# EasyEDA Pro project C题视觉追踪v4.eprj

# Schematic Schematic1
Board Name: Board1; Create Date: 2025-04-20; Page Name: P1; Project Name: C题视觉追踪v4; Schematic Name: Schematic1; Update Date: 2025-05-27; Company: 嘉立创EDA; Page Size: A4; Version: V1.0
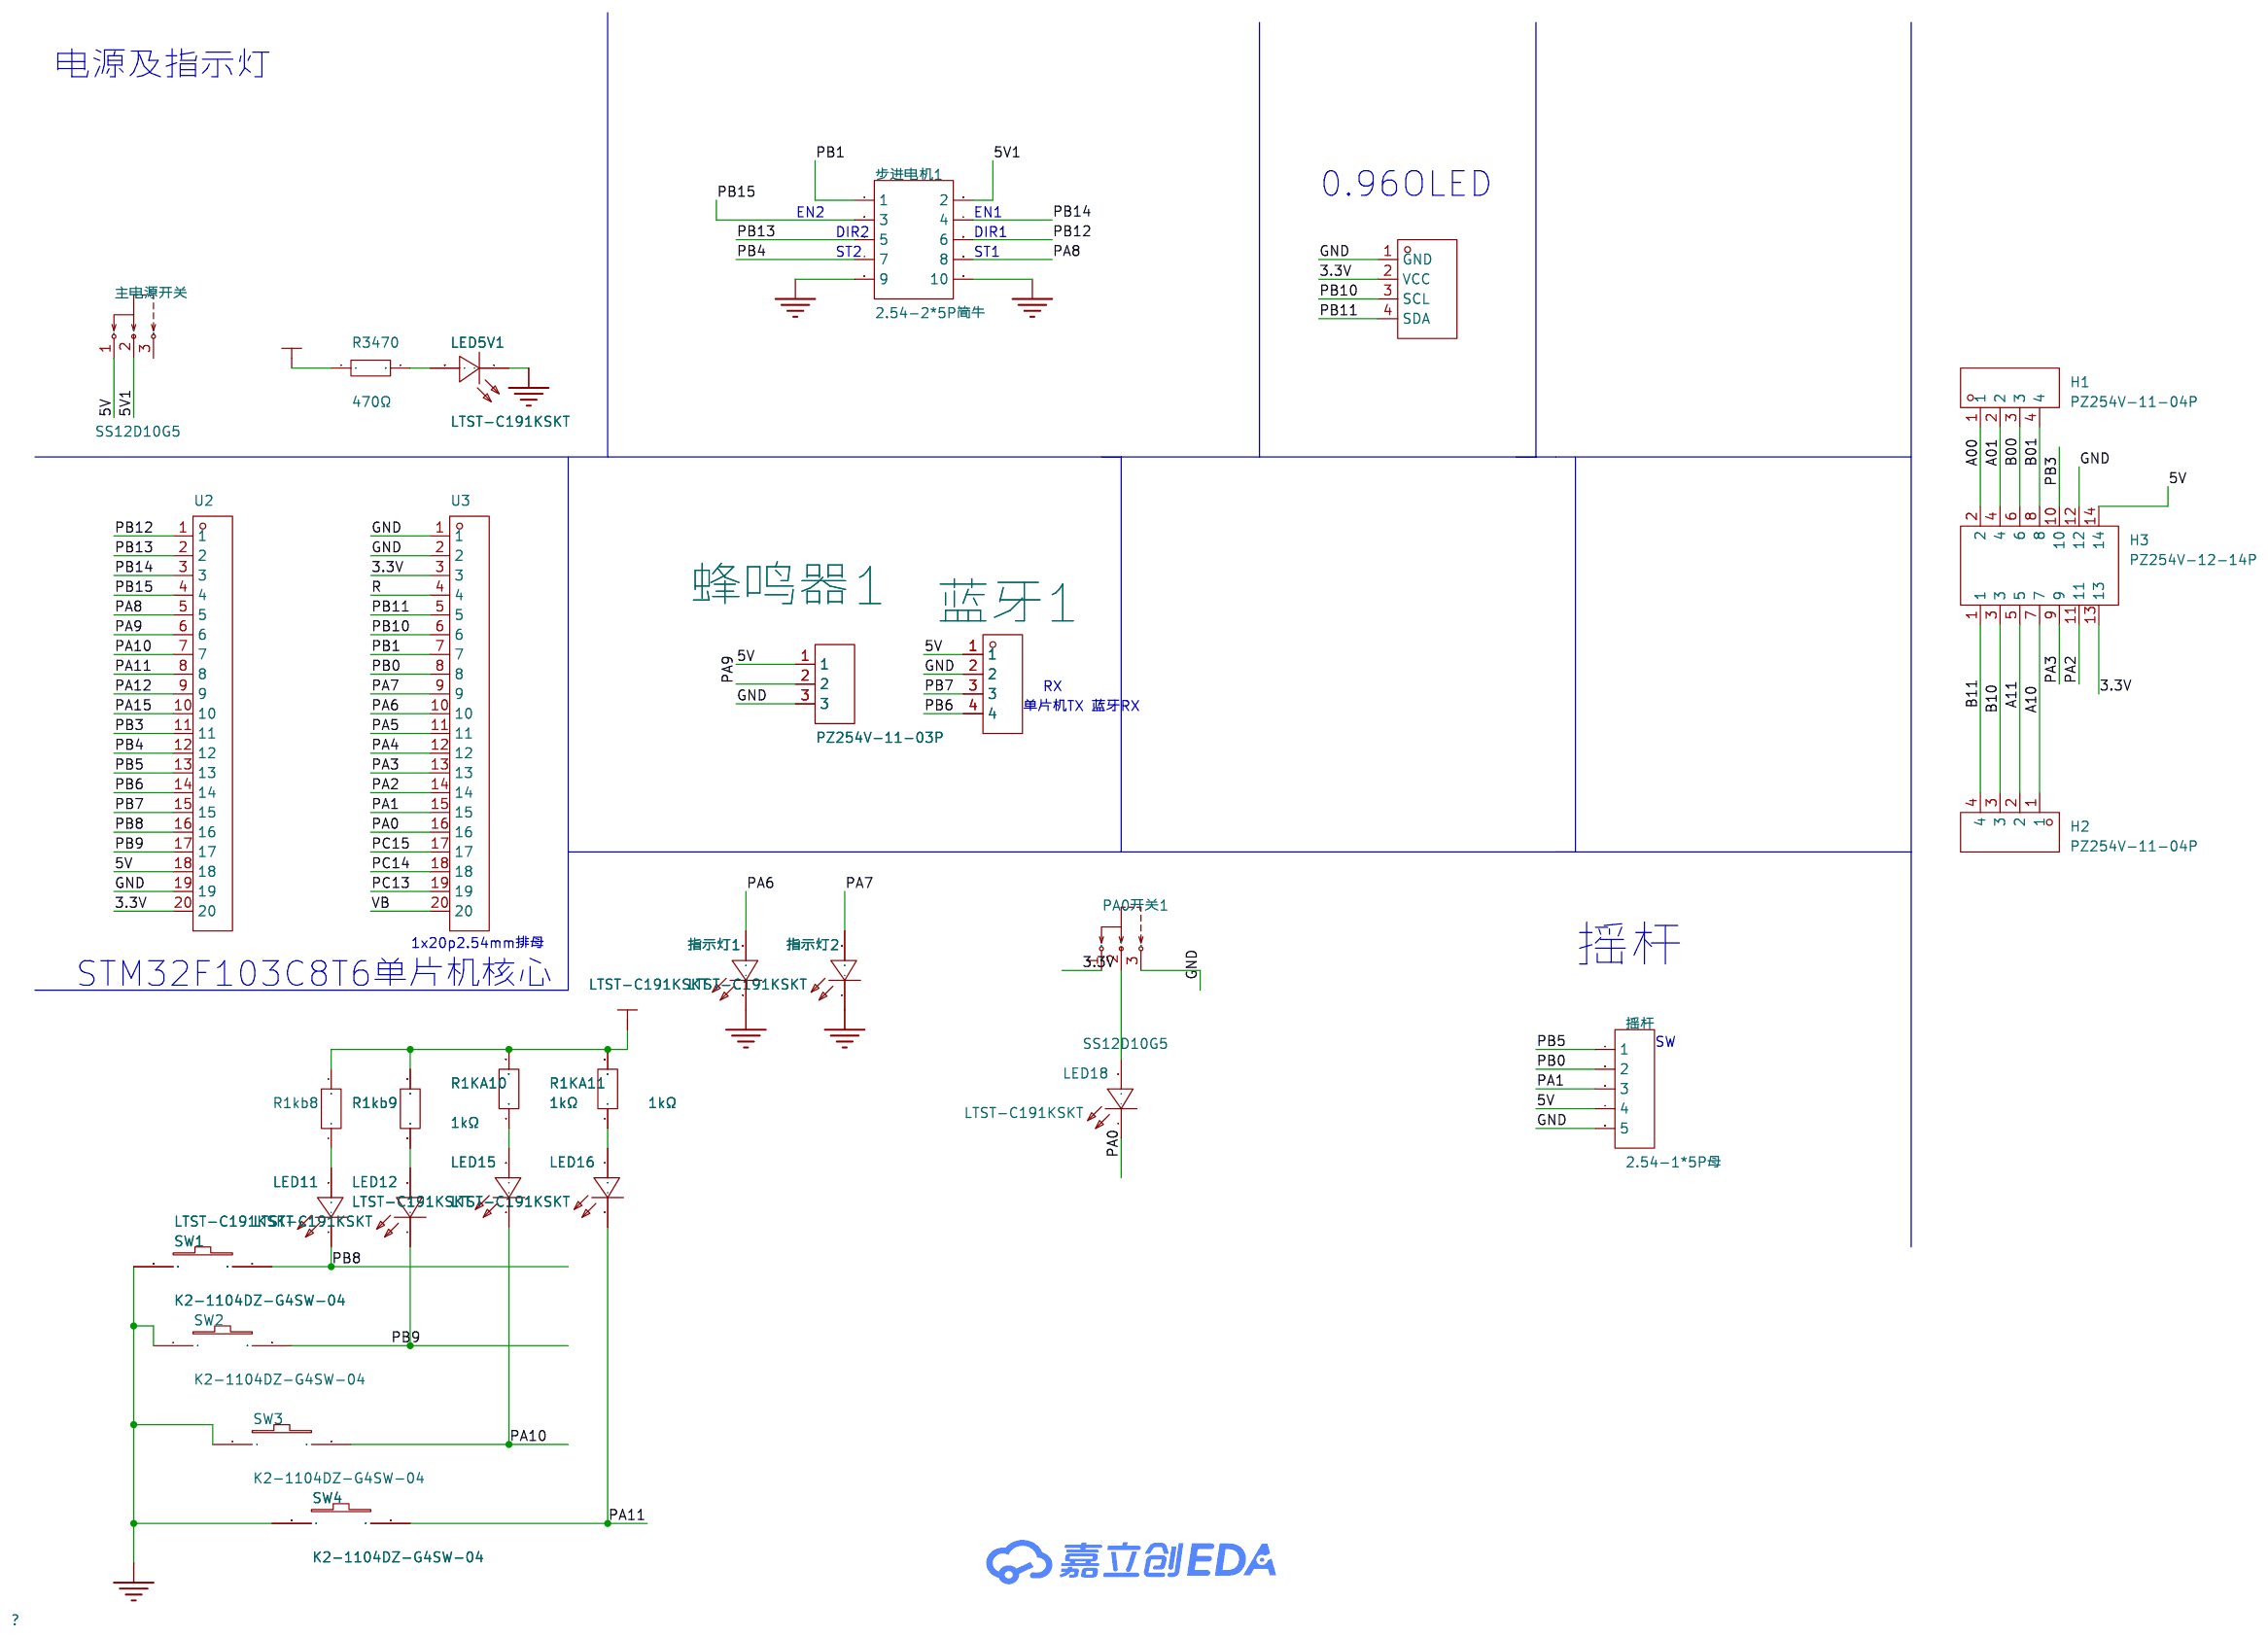
[diagram p0: schematic sheet]

## Parts
H1  PZ254V-11-04P  [HDR-TH_4P-P2.54-V-M]
H2  PZ254V-11-04P  [HDR-TH_4P-P2.54-V-M]
H3  PZ254V-12-14P  [IDC-TH_14P-P2.54_T821114A1S100CEU]
LED5V1  LTST-C191KSKT  [LED0603-RD-YELLOW]
LED11  LTST-C191KSKT  [LED0603-RD-YELLOW]
LED12  LTST-C191KSKT  [LED0603-RD-YELLOW]
LED15  LTST-C191KSKT  [LED0603-RD-YELLOW]
LED16  LTST-C191KSKT  [LED0603-RD-YELLOW]
LED18  LTST-C191KSKT  [LED0603-RD-YELLOW]
OLED1  HS96L03W2C03  [OLED-TH_L27.8-W27.2-P2.54_C9900033791]
PA0开关1  SS12D10G5  [SW-TH_SHOU-HAN_SS12D10G4]
R1KA10  1kΩ  [R0603]
R1KA11  1kΩ  [R0603]
R1kb8  1kΩ  [R0603]
R1kb9  1kΩ  [R0603]
R3470  470Ω  [R0603]
SW1  K2-1104DZ-G4SW-04  [KEY-TH_2P-L6.0-W6.0-P5.00]
SW2  K2-1104DZ-G4SW-04  [KEY-TH_2P-L6.0-W6.0-P5.00]
SW3  K2-1104DZ-G4SW-04  [KEY-TH_2P-L6.0-W6.0-P5.00]
SW4  K2-1104DZ-G4SW-04  [KEY-TH_2P-L6.0-W6.0-P5.00]
U2  KH-2FH-1X20P-H4.3  [hdr-th_20p-p2.54-v-f]
U3  KH-2FH-1X20P-H4.3  [hdr-th_20p-p2.54-v-f]
主电源开关  SS12D10G5  [SW-TH_SHOU-HAN_SS12D10G4]
指示灯1  LTST-C191KSKT  [LED0603-RD-YELLOW]
指示灯2  LTST-C191KSKT  [LED0603-RD-YELLOW]
摇杆  2.54-1*5P母  [HDR-TH_5P-P2.54-V-F]
步进电机1  2.54-2*5P简牛  [IDC-TH_10P-P2.54_C5665]
蓝牙1  2.54-1*4P母  [HDR-TH_4P-P2.54-V-F]
蜂鸣器1  PZ254V-11-03P  [HDR-TH_3P-P2.54-V-M]

## Library data of the parts
H1 H2 = PZ254V-11-04P: 插针结构:1x4P;间距:2.54mm;行距:-;圆针/方针:方针;安装类型:直插;排数:单排;总PIN位数:4P;额定电流:3A;额定电压:250V;配合针长度:6mm;塑高:2.5mm;端接针长度:3mm;触头材质:-;工作温度范围:-40℃~+105℃;颜色:黑色;; LCSC Part Name: 间距:2.54mm 1x4P 直插 方针; Supplier Part: C2691448; Manufacturer: XFCN(兴飞); Supplier Footprint: 插件,P=2.54mm; JLCPCB Part Class: 扩展库; Datasheet: https://atta.szlcsc.com/upload/public/pdf/source/20200309/C492403_F9F19131791D08044AD4F84F8E751A34.pdf; Supplier: LCSC; Pin Structure: 1x4P; Pitch: 2.54mm; Circluar Pins/Square Pins: 方针; Mounting Type: 直插; Number of Rows: 单排; Number of Pins: 4P; Current Rating (Max): 3A; Voltage Rating (Max): 250V; Length of Mating Pin: 6mm; Insulation Height: 2.5mm; Length of End Connection Pin: 3mm; Operating Temperature Range: -40℃~+105℃; Color: 黑色
H3 = PZ254V-12-14P: LCSC Part Name: 2x7P 间距:2.54mm 方针 直插; Supplier Part: C492424; Manufacturer: XFCN(兴飞); Supplier Footprint: 插件,P=2.54mm; JLCPCB Part Class: 扩展库; Datasheet: https://atta.szlcsc.com/upload/public/pdf/source/20200309/C492424_D71F2B7B4151908BA6AE7E1F567EA536.pdf; Supplier: LCSC; Pin Structure: 2x7P; Pitch: 2.54mm; Row Spacing: 2.54mm; Circluar Pins/Square Pins: 方针; Mounting Type: 直插; Number of Rows: 双排; Number of Pins: 14P; Length of Mating Pin: 6mm; Insulation Height: 2.5mm; Length of End Connection Pin: 3mm; Contact Material: 黄铜; Operating Temperature: -40℃~+105℃; Color: 黑色
LED5V1 LED11 LED12 LED15 LED16 LED18 指示灯1 指示灯2 = LTST-C191KSKT: 发光颜色:黄色;正向电压(VF):2.1V;功率:75mW;正向电流:20mA;主波长:584.5nm~597nm;二极管配置:-;透镜颜色:无色透明透镜;色温:-;发光强度:104mcd;发光角度:130°;载带方式:-;工作温度:-55℃~+85℃;; LCSC Part Name: 黄灯; Supplier Part: C125100; Manufacturer: LITEON(光宝); Supplier Footprint: 0603; JLCPCB Part Class: 扩展库; Datasheet: https://atta.szlcsc.com/upload/public/pdf/source/20180129/C125100_15171877314981315871.pdf; Supplier: LCSC; Emitted Color: 黄色; Forward Voltage (VF): 2.1V; Power Dissipation: 75mW; Forward Current: 20mA; Dominant Wavelength: 584.5nm~597nm; Peak Wavelength: 588nm; Lens Color: 无色透明透镜; Luminous Intensity: 104mcd; Viewing Angle: 130°; Operating Temperature: -55℃~+85℃
OLED1 = HS96L03W2C03: 主控芯片:SSD1315;接口类型:I2C;尺寸(inch):0.96;像素分辨率:128x64;; LCSC Part Name: 0.96寸OLED显示屏窄白光IIC; Supplier Part: C5248080; Manufacturer: HS(汉昇); JLCPCB Part Class: 扩展库; Datasheet: https://atta.szlcsc.com/upload/public/pdf/source/20230627/763D01F79A90007632F098068C7C8AD9.pdf; Supplier: LCSC; Main Control Chip: SSD1315; Interface Type: I2C; Size: 0.96; Pixel Resolution: 128x64; Operating Temperature: -40℃~+70℃
PA0开关1 主电源开关 = SS12D10G5: 电路结构:单刀双掷;安装方式:直插;额定电流(DC):2A;额定电压(DC):125V;机械寿命:3千次;; LCSC Part Name: 两档立式插件 3脚拨动开关 柄长5.0mm; Supplier Part: C7431054; Manufacturer: SHOU HAN(首韩); Supplier Footprint: 插件; JLCPCB Part Class: 扩展库; Datasheet: https://atta.szlcsc.com/upload/public/pdf/source/20231130/7A3DB6A149BF0A1DCFFE64FFC07FE434.pdf; Supplier: LCSC; Circuit: 单刀双掷; Switch Length: 12.7mm; Switch Width: 6.7mm; Mounting Style: 直插; Current Rating (DC): 2A; Voltage Rating (DC): 125V; Mechanical Life: 3千次; Operating Temperature: -25℃~+70℃
R1KA10 R1KA11 R1kb8 R1kb9 = FCR0603F1K: 电阻类型:厚膜电阻;阻值:1kΩ;精度:±1%;功率:100mW;最大工作电压:75V;; LCSC Part Name: 1K ±1%; Supplier Part: C5913168; Manufacturer: VO(翔胜); Supplier Footprint: 0603; JLCPCB Part Class: 扩展库; Datasheet: https://atta.szlcsc.com/upload/public/pdf/source/20230428/98B65D379E9BA4CF2A9223D1647B01B6.pdf; Supplier: LCSC; Type: 厚膜电阻; Tolerance: ±1%; Power(Watts): 100mW; Overload Voltage (Max): 75V; Operating Temperature Range: -55℃~+155℃
R3470 = 0603WAF4700T5E: 电阻类型:厚膜电阻;阻值:470Ω;精度:±1%;功率:100mW;最大工作电压:75V;温度系数:±100ppm/℃;; LCSC Part Name: 470Ω ±1% 100mW 厚膜电阻; Supplier Part: C23179; Manufacturer: UNI-ROYAL(厚声); Supplier Footprint: 0603; JLCPCB Part Class: 基础库; Datasheet: https://atta.szlcsc.com/upload/public/pdf/source/20200306/C422600_1E6D84923E4A46A82E41ADD87F860B5C.pdf; Supplier: LCSC; Type: 厚膜电阻; Tolerance: ±1%; Power(Watts): 100mW; Overload Voltage (Max): 75V; Temperature Coefficient: ±100ppm/℃; Operating Temperature Range: -55℃~+155℃
SW1-SW4 = K2-1104DZ-G4SW-04: 作用力:250gf;安装方式:直插;开关长度:6mm;开关宽度:6mm;开关高度:7mm;触点电流:50mA;额定电压(DC):12V;绝缘电阻:100MΩ;机械寿命:10万次;; LCSC Part Name: 6*6*7 两脚长脚开关; Supplier Part: C961736; Manufacturer: 韩国韩荣; Supplier Footprint: 插件; JLCPCB Part Class: 扩展库; Datasheet: https://atta.szlcsc.com/upload/public/pdf/source/20201126/C961736_4F85C6E6E5B3656D5DC7C0B00D034F4A.pdf; Supplier: LCSC; Operating Force: 250gf; Mounting Style: 直插; Switch Length: 6mm; Switch Width: 6mm; Switch Height: 7mm; Contact Current: 50mA; Voltage Rating (DC): 12V; Insulation Resistance: 100MΩ; Mechanical Life: 10万次; Operating Temperature: -25℃~+85℃
U2 U3 = KH-2FH-1X20P-H4.3: 插孔结构:1x20P;间距:2mm;行距:-;圆孔/方孔:方孔;安装类型:直插;排数:单排;总孔位数:20P;额定电流:1.5A;额定电压:-;插孔方向:顶部;塑高:4.3mm;工作温度范围:-40℃~+105℃;; LCSC Part Name: 间距:2mm 1x20P 直插; Supplier Part: C2938439; Manufacturer: kinghelm(金航标); Supplier Footprint: 插件,P=2mm; JLCPCB Part Class: 扩展库; Datasheet: https://atta.szlcsc.com/upload/public/pdf/source/20211228/5EC70B7FC510D3D80A3799409C3607F1.pdf; Supplier: LCSC; Holes Structure: 1x20P; Pitch: 2mm; Circular Hole / Square Hole: 方孔; Mounting Type: 直插; Number of Rows: 单排; Number of Holes: 20P; Current Rating (Max): 1.5A; Holes Direction: 顶部; Insulation Height: 4.3mm; Operating Temperature Range: -40℃~+105℃
摇杆 = 2.54-1*5P母: 插孔结构:1x5P;间距:2.54mm;行距:-;安装类型:直插;排数:单排;总孔位数:5P;塑高:-;触头材质:-;触头镀层:-;; LCSC Part Name: 间距:2.54mm 1x5P 直插; Supplier Part: C50950; Manufacturer: BOOMELE(博穆精密); Supplier Footprint: 插件,P=2.54mm; JLCPCB Part Class: 扩展库; Datasheet: https://atta.szlcsc.com/upload/public/pdf/source/20210301/C2718488_F4427B881E42CAA8DDB0B1C12B3A522C.pdf; Supplier: LCSC; Holes Structure: 1x5P; Pitch: 2.54mm; Mounting Type: 直插; Number of Rows: 单排; Number of Holes: 5P
步进电机1 = 2.54-2*5P简牛: 连接器类型:简牛座;间距:2.54mm;结构:2x5P;封装形式:直插;行距:2.54mm;排数:2;每排PIN数:5;触头材质:-;触头镀层:-;; LCSC Part Name: 2.54mm 2x5P 排数:2 每排P数:5; Supplier Part: C5665; Manufacturer: BOOMELE(博穆精密); Supplier Footprint: 插件,P=2.54mm; JLCPCB Part Class: 扩展库; Datasheet: https://atta.szlcsc.com/upload/public/pdf/source/20140331/1457707037896.pdf; Supplier: LCSC; Connector Type: 简牛座; Pitch: 2.54mm; Structure: 2x5P; Holder Type: 直插; Row Spacing: 2.54mm; Number of Rows: 2; Pin Number in each Row: 5
蓝牙1 = 2.54-1*4P母: 插孔结构:1x4P;间距:2.54mm;行距:-;圆孔/方孔:方孔;安装类型:直插;排数:单排;总孔位数:4P;额定电流:3A;额定电压:-;插孔方向:顶部;塑高:-;触头材质:青铜;触头镀层:-;工作温度范围:-40℃~+105℃;焊接温度(最大值):-;; LCSC Part Name: 间距:2.54mm 1x4P 直插; Supplier Part: C2718488; Manufacturer: BOOMELE(博穆精密); Supplier Footprint: 插件,P=2.54mm; JLCPCB Part Class: 扩展库; Datasheet: https://atta.szlcsc.com/upload/public/pdf/source/20210301/C2718488_F4427B881E42CAA8DDB0B1C12B3A522C.pdf; Supplier: LCSC; Holes Structure: 1x4P; Pitch: 2.54mm; Circular Hole / Square Hole: 方孔; Mounting Type: 直插; Number of Rows: 单排; Number of Holes: 4P; Current Rating (Max): 3A; Holes Direction: 顶部; Contact Material: 青铜; Operating Temperature Range: -40℃~+105℃
蜂鸣器1 = PZ254V-11-03P: 插针结构:1x3P;间距:2.54mm;行距:-;圆针/方针:方针;安装方式:直插;排数:单排;总PIN位数:3P;额定电流:3A;额定电压:250V;配合针长度:6mm;塑高:2.5mm;端接针长度:3mm;工作温度:-40℃~+105℃;颜色:黑色;; LCSC Part Name: 1x3P 间距:2.54mm 方针 直插; Supplier Part: C2937625; Manufacturer: XFCN(兴飞); Supplier Footprint: 插件,P=2.54mm; JLCPCB Part Class: 扩展库; Datasheet: https://atta.szlcsc.com/upload/public/pdf/source/20200309/C492402_8335C3D49C4E4C618838D59BB1D024C1.pdf; Supplier: LCSC; Pin Structure: 1x3P; Pitch: 2.54mm; Circluar Pins/Square Pins: 方针; Mounting Type: 直插; Number of Rows: 单排; Number of Pins: 3P; Current Rating: 3A; Voltage Rating (Max): 250V; Length of Mating Pin: 6mm; Insulation Height: 2.5mm; Length of End Connection Pin: 3mm; Operating Temperature: -40℃~+105℃; Color: 黑色

## Nets
3.3V: H3.13 OLED1.2(VCC) PA0开关1.1 R1KA10.2 R1KA11.2 R1kb8.2 R1kb9.2 U2.20 U3.3
5V: H3.14 R3470.1 U2.18 主电源开关.1 摇杆.4 蓝牙1.1 蜂鸣器1.1
5V1: 主电源开关.2 步进电机1.2
GND: H3.12 LED5V1.1(-) OLED1.1(GND) PA0开关1.3 SW1.1 SW2.1 SW3.1 SW4.1 U2.19 U3.1 U3.2 指示灯1.1(-) 指示灯2.1(-) 摇杆.5 步进电机1.9 步进电机1.10 蓝牙1.2 蜂鸣器1.3
A00: H1.1 H3.2
A01: H1.2 H3.4
A10: H2.1 H3.7
A11: H2.2 H3.5
B00: H1.3 H3.6
B01: H1.4 H3.8
B10: H2.3 H3.3
B11: H2.4 H3.1
PA0: LED18.1(-) U3.16
PA1: U3.15 摇杆.3
PA2: H3.11 U3.14
PA3: H3.9 U3.13
PA4: U3.12
PA5: U3.11
PA6: U3.10 指示灯1.2(+)
PA7: U3.9 指示灯2.2(+)
PA8: U2.5 步进电机1.8
PA9: U2.6 蜂鸣器1.2
PA10: LED15.1(-) SW3.2 U2.7
PA11: LED16.1(-) SW4.2 U2.8
PA12: U2.9
PA15: U2.10
PB0: U3.8 摇杆.2
PB1: U3.7 步进电机1.1
PB3: H3.10 U2.11
PB4: U2.12 步进电机1.7
PB5: U2.13 摇杆.1
PB6: U2.14 蓝牙1.4
PB7: U2.15 蓝牙1.3
PB8: LED11.1(-) SW1.2 U2.16
PB9: LED12.1(-) SW2.2 U2.17
PB10: OLED1.3(SCL) U3.6
PB11: OLED1.4(SDA) U3.5
PB12: U2.1 步进电机1.6
PB13: U2.2 步进电机1.5
PB14: U2.3 步进电机1.4
PB15: U2.4 步进电机1.3
PC13: U3.19
PC14: U3.18
PC15: U3.17
R: U3.4
VB: U3.20
$1N1920: LED5V1.2(+) R3470.2
$1N2056: LED11.2(+) R1kb8.1
$1N2059: LED12.2(+) R1kb9.1
$1N2097: LED15.2(+) R1KA10.1
$1N2098: LED16.2(+) R1KA11.1
$1N9373: LED18.2(+) PA0开关1.2

Not connected (* = marked no-connect by the designer): 主电源开关 3

## Notes on the sheet
- 电源及指示灯
- 0.96OLED
- EN2
- EN1
- DIR2
- DIR1
- ST2
- ST1
- RX
- 单片机TX 蓝牙RX
- 1x20p2.54mm排母
- 摇杆
- STM32F103C8T6单片机核心
- SW

# Board PCB1
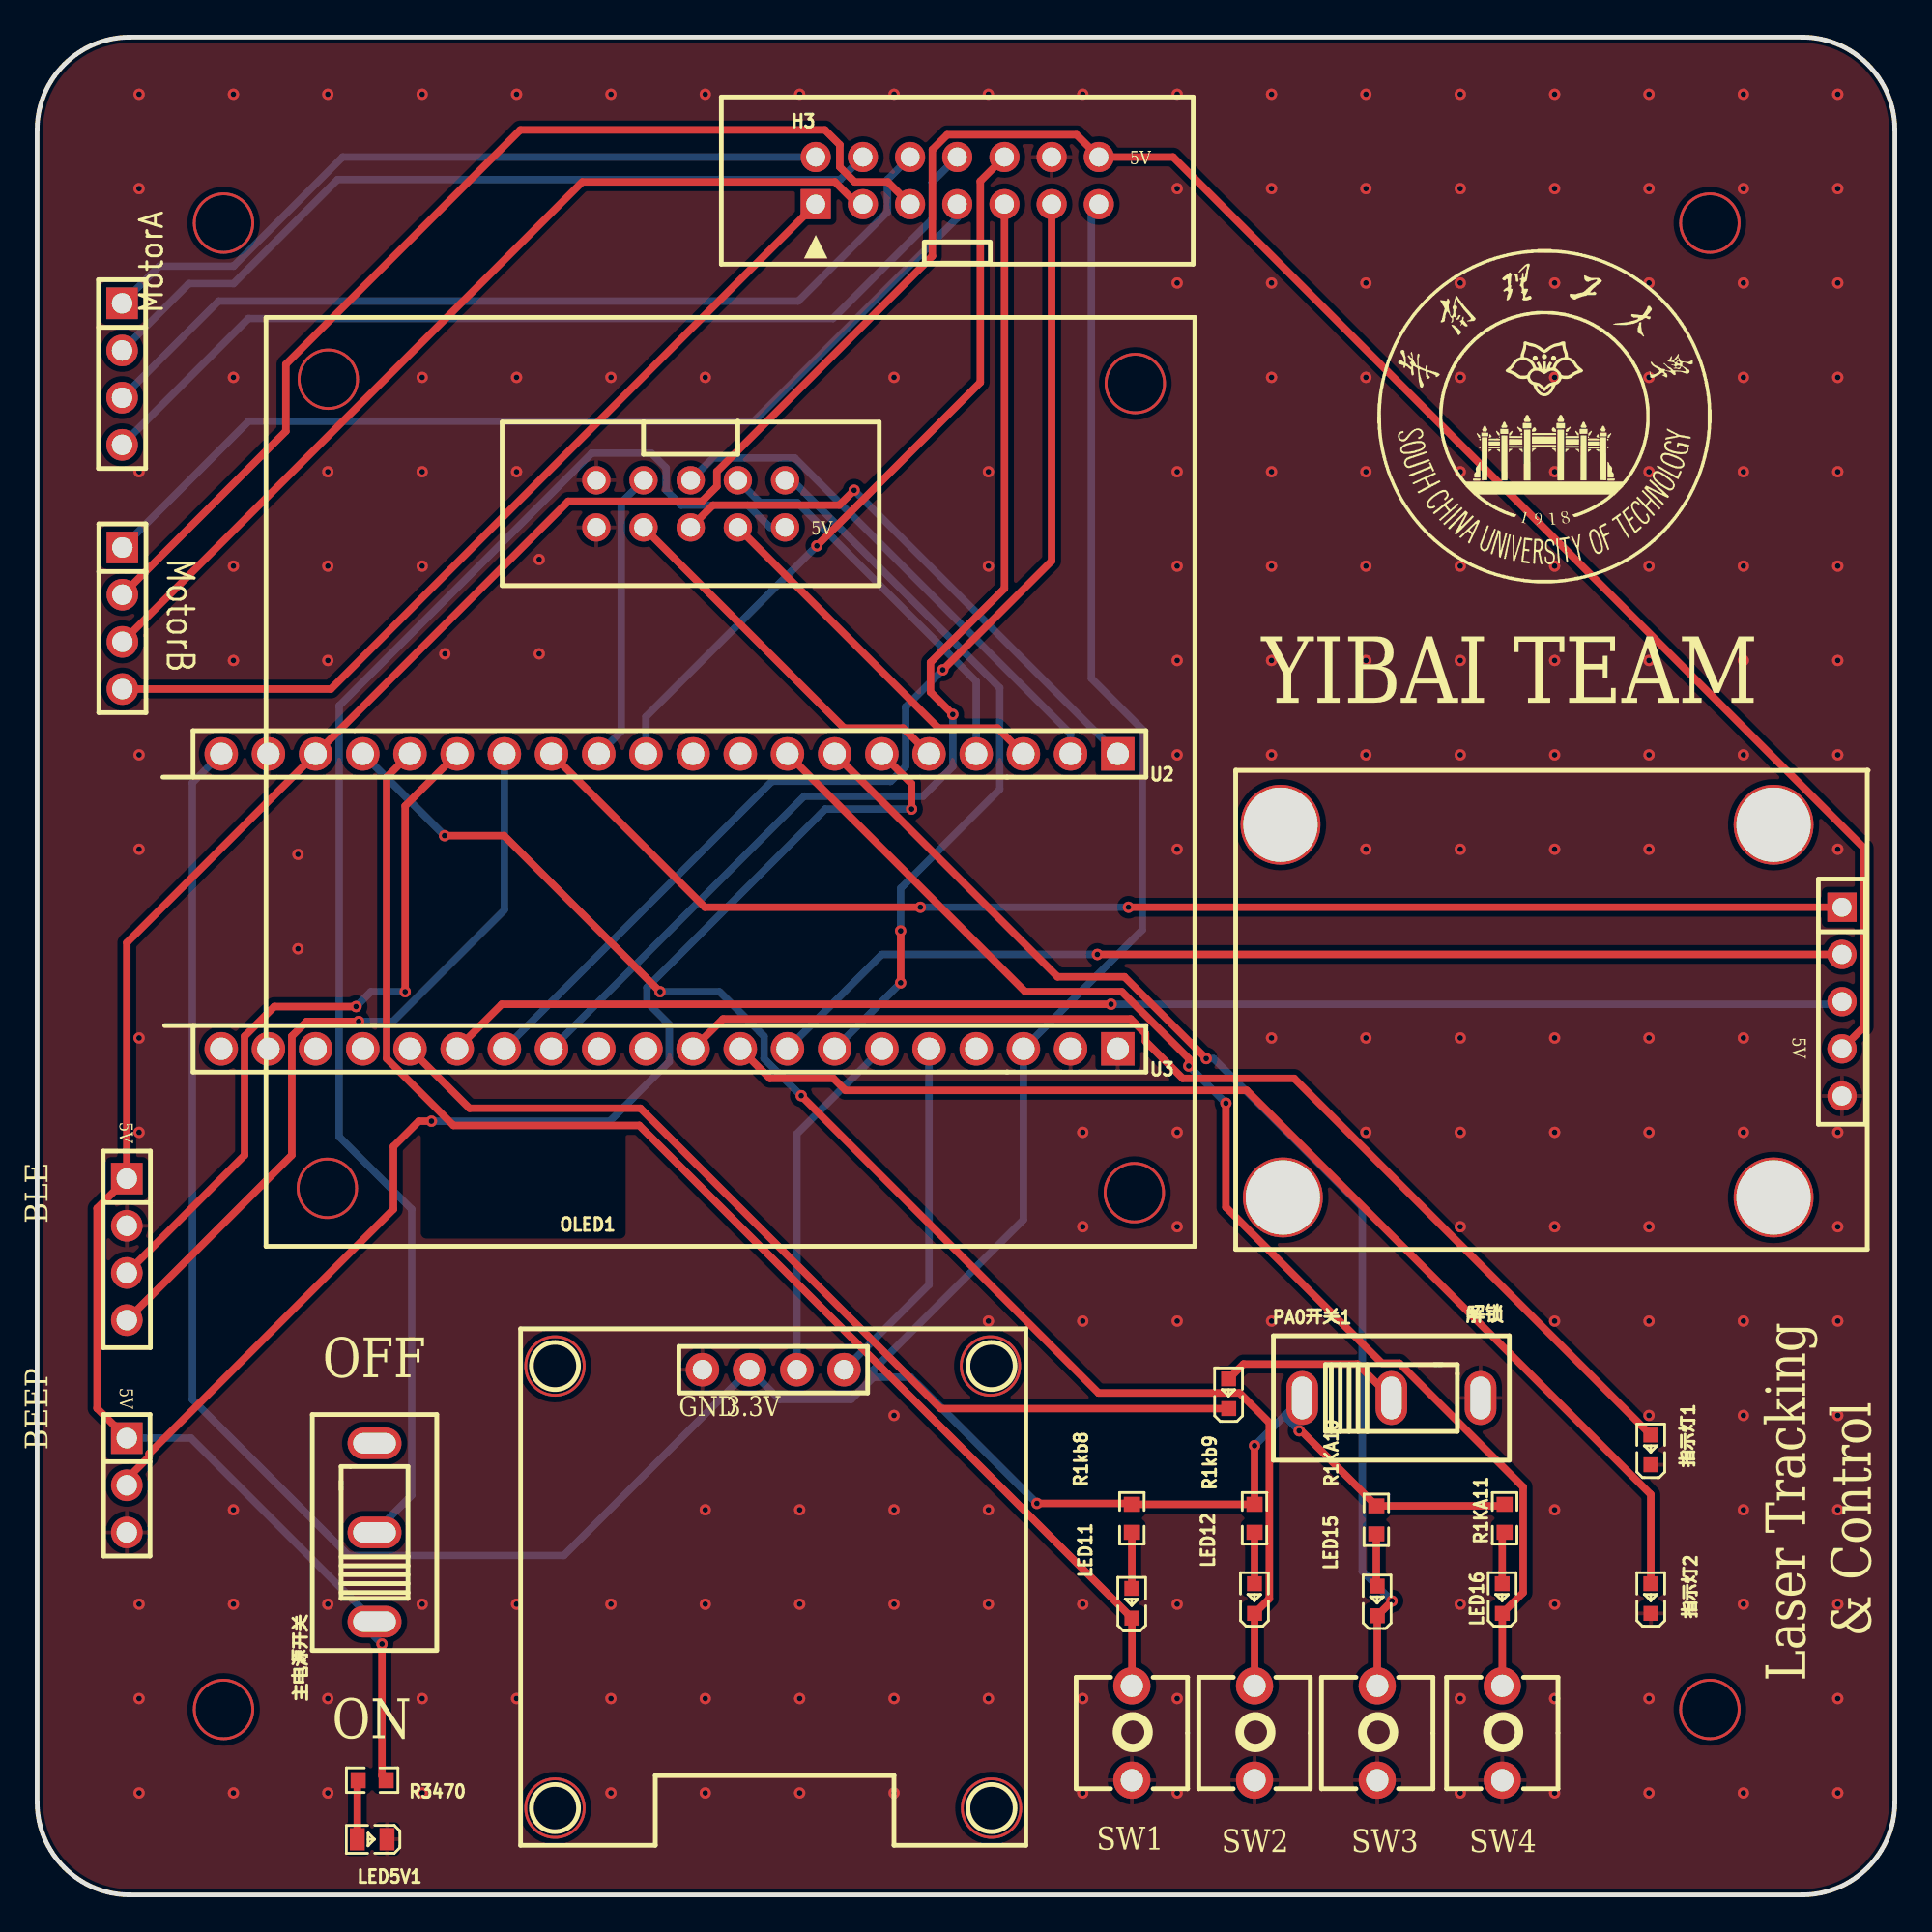
[diagram p1: board, top side]
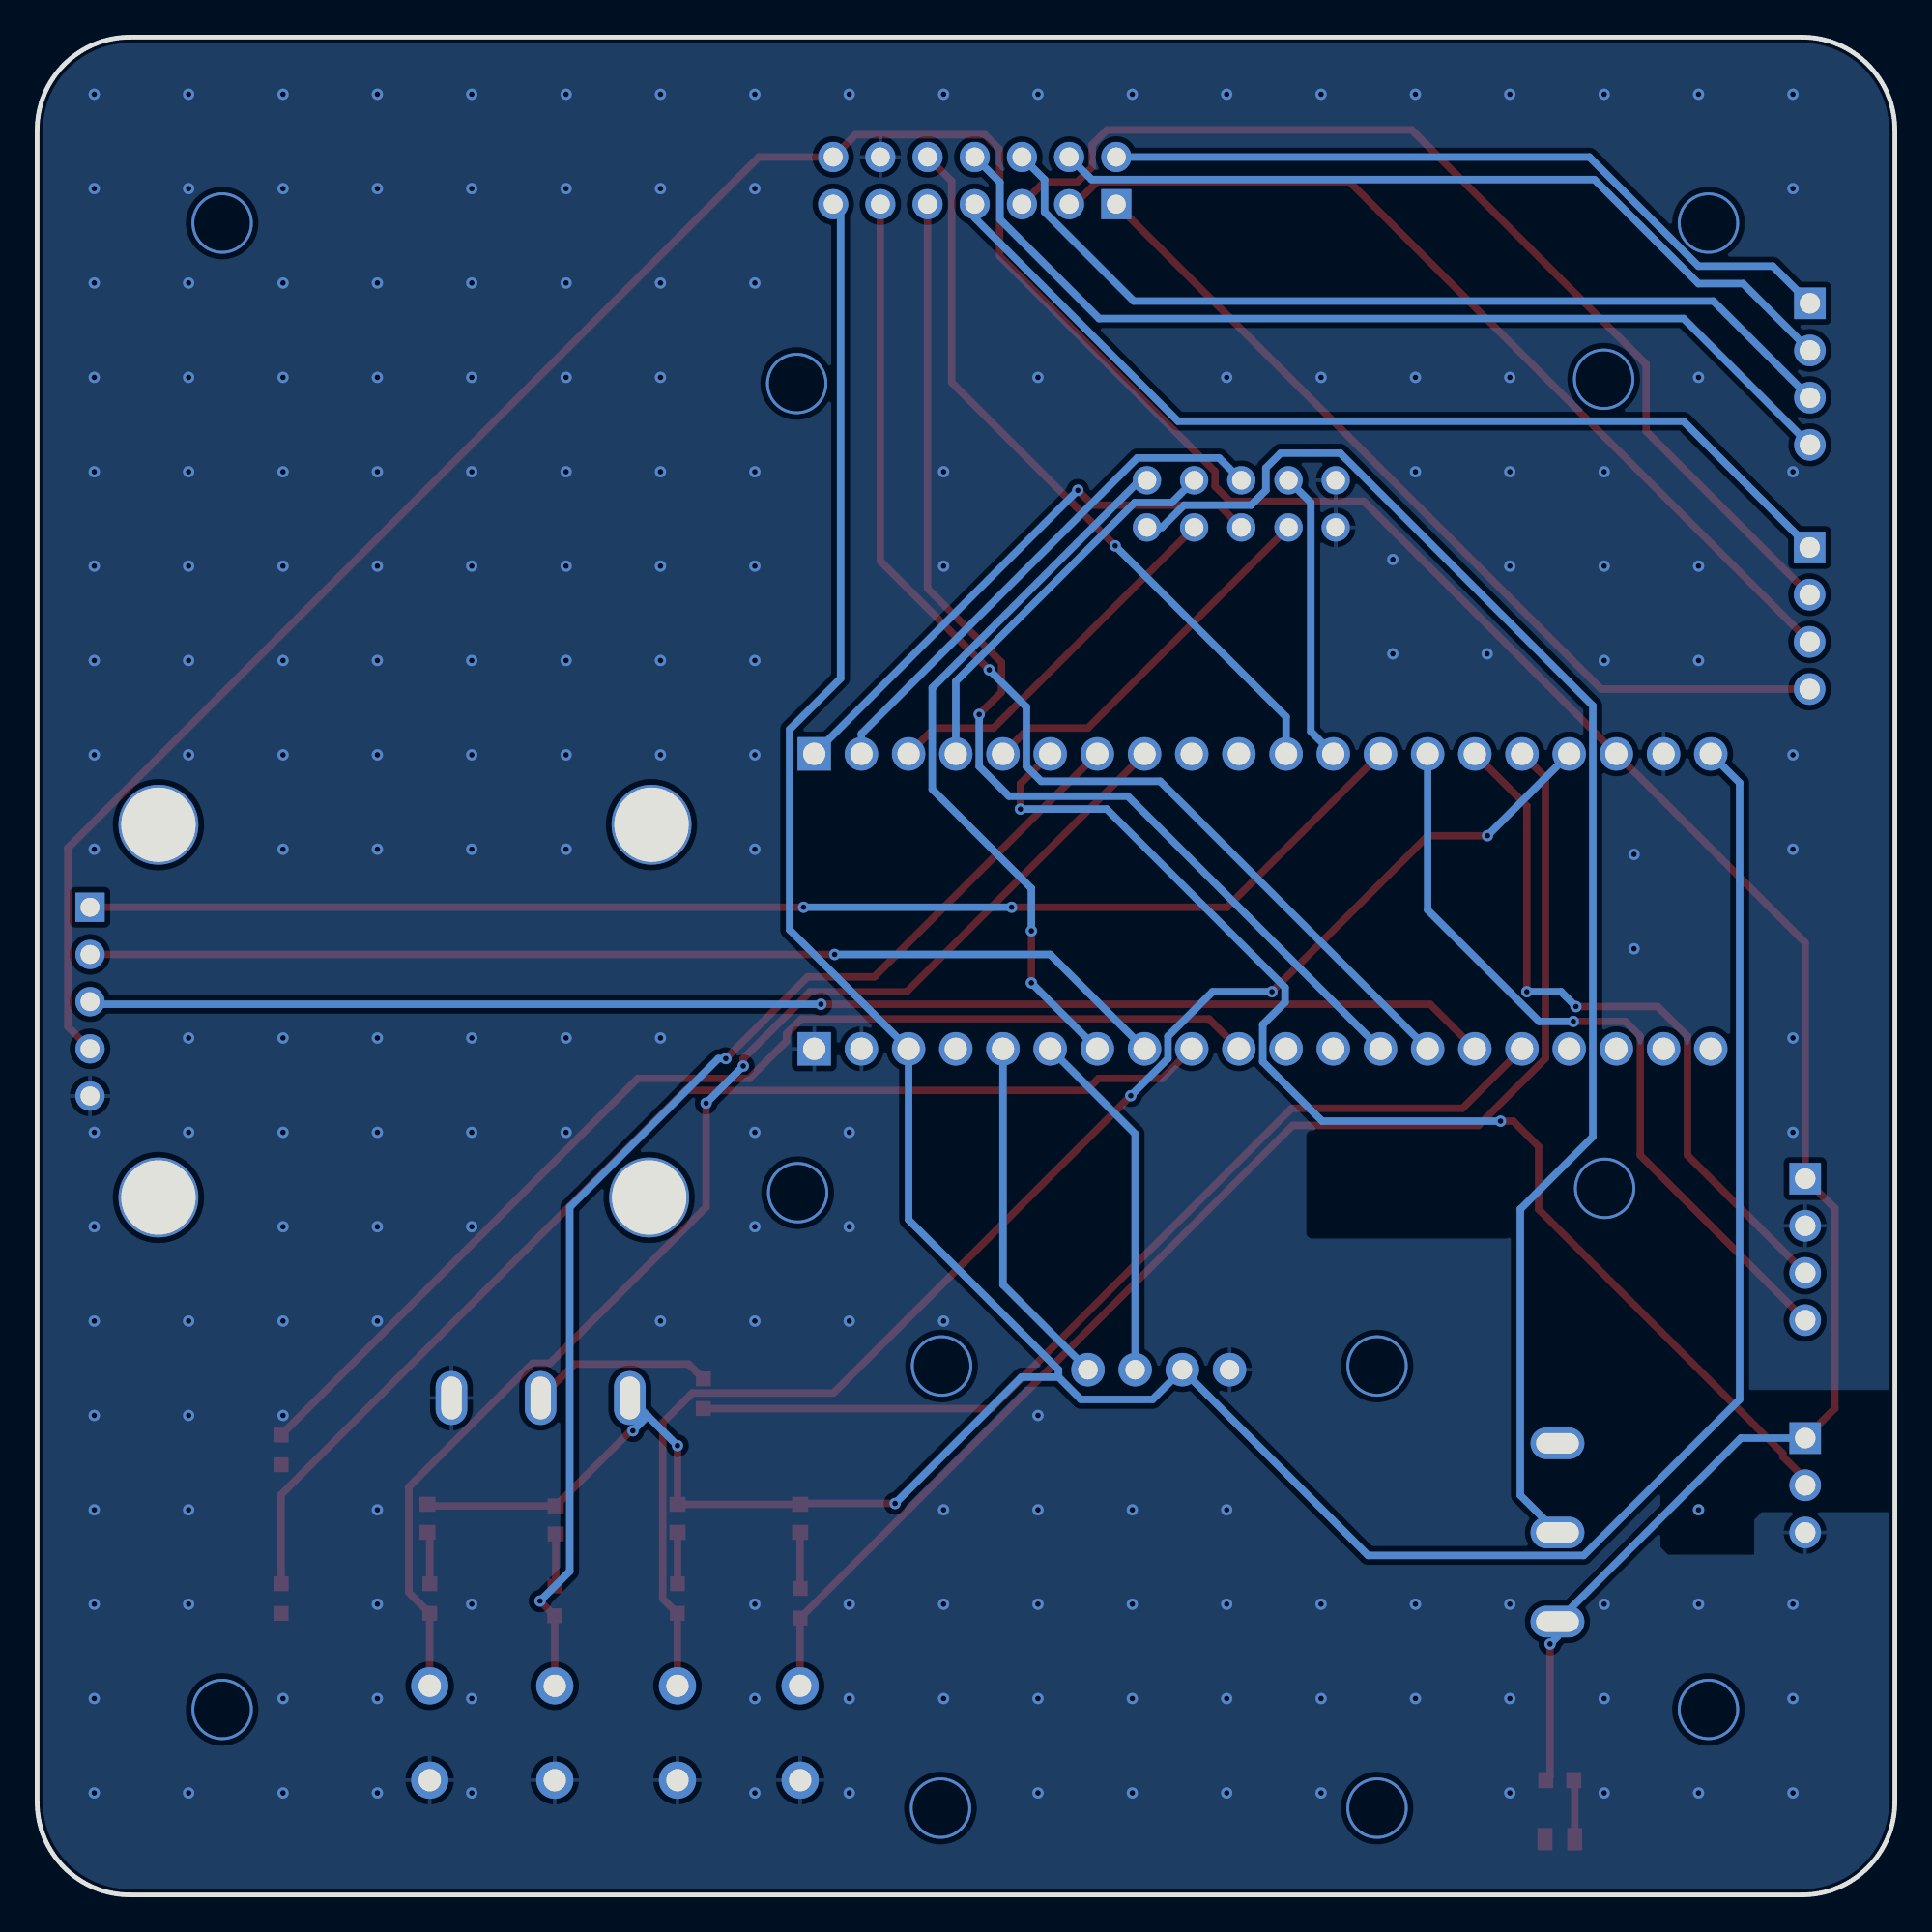
[diagram p2: board, bottom side, seen from below]

Outline 100 x 100 mm; copper layers: Top Layer, Bottom Layer. Coordinates in mm from the lower left corner of the outline.
Outline path: 0,95 0,5 arc(1.46,1.46) 5,0 95,0 arc(98.54,1.46) 100,5 100,95 arc(98.54,98.54) 95,100 5,100 arc(1.46,98.54) 0,95
Stack: Top Layer 0.035mm / Dielectric1 1.51mm FR4 er 4.5 / Bottom Layer 0.035mm

## Design rules (mm)
template: 自定义配置
spacing copperThickness1oz (default): track to track 0.102, other pairs 0.152 to 0.3
spacing copperThickness2oz: track to track 0.203, other pairs 0.152 to 0.3
track width copperThickness1oz (default): min 0.127, default 0.4, max 2.54
track width copperThickness2oz: min 0.203, default 0.254, max 2.54
differential pair differentialPair (default): width min 0.127, default 0.254, max 2.54; gap min 0.152, default 0.152
via viaSize (default): diameter min 0.5, default 0.61, max 10; hole min 0.3, default 0.305, max 6.3

## Placement (name value [footprint] x y rotation side)
BEEP  PZ254V-11-03P  [HDR-TH_3P-P2.54-V-M]  4.83 22.05 270 top
BLE  2.54-1*4P母  [HDR-TH_4P-P2.54-V-F]  4.83 34.75 270 top
H2  PZ254V-11-04P  [HDR-TH_4P-P2.54-V-M]  4.59 68.72 270 top
H3  PZ254V-12-14P  [IDC-TH_14P-P2.54_T821114A1S100CEU]  49.53 92.28 0 top
LED5V1  LTST-C191KSKT  [LED0603-RD-YELLOW#2]  18.03 3 180 top
LED11  LTST-C191KSKT  [LED0603-RD-YELLOW]  58.93 15.7 90 top
LED12  LTST-C191KSKT  [LED0603-RD-YELLOW]  65.53 15.95 90 top
LED15  LTST-C191KSKT  [LED0603-RD-YELLOW]  72.14 15.82 90 top
LED16  LTST-C191KSKT  [LED0603-RD-YELLOW]  78.87 15.95 90 top
LED18  LTST-C191KSKT  [LED0603-RD-YELLOW]  64.14 26.98 90 top
MotorA  PZ254V-11-04P  [HDR-TH_4P-P2.54-V-M]  4.57 81.86 270 top
NOREF  -  [Pad_e69]  66.93 57.61 0 top
NOREF#2  -  [Pad_e60]  93.47 37.54 0 top
NOREF#3  -  [Pad_e64]  93.47 57.61 0 top
NOREF#4  -  [Pad_e66]  67.06 37.54 0 top
OLED1  HS96L03W2C03  [OLED-TH_L27.8-W27.2-P2.54_C9900033791]  39.62 28.27 0 top
PA0开关1  SS12D10G5  [SW-TH_SHOU-HAN_SS12D10G4]  72.9 26.75 0 top
R1KA10  1kΩ  [R0603]  72.09 20.19 90 top
R1KA11  1kΩ  [R0603]  78.99 20.27 90 top
R1kb8  1kΩ  [R0603]  58.93 20.27 90 top
R1kb9  1kΩ  [R0603]  65.53 20.27 90 top
R3470  470Ω  [R0603]  18.03 6.17 180 top
SW1  K2-1104DZ-G4SW-04  [KEY-TH_2P-L6.0-W6.0-P5.00]  58.93 8.71 90 top
SW2  K2-1104DZ-G4SW-04  [KEY-TH_2P-L6.0-W6.0-P5.00]  65.53 8.71 90 top
SW3  K2-1104DZ-G4SW-04  [KEY-TH_2P-L6.0-W6.0-P5.00]  72.14 8.71 90 top
SW4  K2-1104DZ-G4SW-04  [KEY-TH_2P-L6.0-W6.0-P5.00]  78.87 8.71 90 top
U2  KH-2FH-1X20P-H4.3  [hdr-th_20p-p2.54-v-f]  34.04 61.42 180 top
U3  KH-2FH-1X20P-H4.3  [hdr-th_20p-p2.54-v-f]  34.04 45.54 180 top
主电源开关  SS12D10G5  [SW-TH_SHOU-HAN_SS12D10G4]  18.16 19.51 90 top
指示灯1  LTST-C191KSKT  [LED0603-RD-YELLOW]  86.87 23.95 90 top
指示灯2  LTST-C191KSKT  [LED0603-RD-YELLOW]  86.87 15.95 90 top
摇杆  2.54-1*5P母  [HDR-TH_5P-P2.54-V-F]  97.16 48.08 270 top
步进电机1  2.54-2*5P简牛  [IDC-TH_10P-P2.54_C5665]  35.18 74.88 180 top

## Footprints (pads in the part's own frame, mm; a bottom-side part is the same pattern mirrored in y, then rotated)
HDR-TH_3P-P2.54-V-M
  rect 1.7x1.7 hole 1.1: 1(-2.54,0)
  round 1.7 hole 1.1: 2(0,0) 3(2.54,0)
HDR-TH_4P-P2.54-V-F
  rect 1.7x1.7 hole 1.1: 1(-3.81,0)
  round 1.7 hole 1.1: 2(-1.27,0) 3(1.27,0) 4(3.81,0)
HDR-TH_4P-P2.54-V-M
  rect 1.7x1.7 hole 1.1: 1(-3.81,0)
  round 1.7 hole 1.1: 2(-1.27,0) 3(1.27,0) 4(3.81,0)
HDR-TH_5P-P2.54-V-F
  rect 1.575x1.575 hole 1.02: 1(-5.08,0)
  round 1.575 hole 1.02: 2(-2.54,0) 3(0,0) 4(2.54,0) 5(5.08,0)
hdr-th_20p-p2.54-v-f
  rect 1.8x1.8 hole 1.2: 1(-24.13,0)
  round 1.8 hole 1.2: 2(-21.59,0) 3(-19.05,0) 4(-16.51,0) 5(-13.97,0) 6(-11.43,0) 7(-8.89,0) 8(-6.35,0) 9(-3.81,0) 10(-1.27,0) 11(1.27,0) 12(3.81,0) 13(6.35,0) 14(8.89,0) 15(11.43,0) 16(13.97,0) 17(16.51,0) 18(19.05,0) 19(21.59,0) 20(24.13,0)
IDC-TH_10P-P2.54_C5665
  round 1.524 hole 1: 1(-5.08,-1.27) 2(-5.08,1.27) 3(-2.54,-1.27) 4(-2.54,1.27) 5(0,-1.27) 6(0,1.27) 7(2.54,-1.27) 8(2.54,1.27) 9(5.08,-1.27) 10(5.08,1.27)
IDC-TH_14P-P2.54_T821114A1S100CEU
  rect 1.62x1.62 hole 1.02: 1(-7.62,-1.27)
  round 1.62 hole 1.02: 2(-7.62,1.27) 3(-5.08,-1.27) 4(-5.08,1.27) 5(-2.54,-1.27) 6(-2.54,1.27) 7(0,-1.27) 8(0,1.27) 9(2.54,-1.27) 10(2.54,1.27) 11(5.08,-1.27) 12(5.08,1.27) 13(7.62,-1.27) 14(7.62,1.27)
KEY-TH_2P-L6.0-W6.0-P5.00
  round 2 hole 1.2: 1(-2.54,0) 2(2.54,0)
LED0603-RD-YELLOW
  rect 0.8x0.8 smd: 1(-0.799,-0.004) 2(0.799,0.004)
LED0603-RD-YELLOW#2
  rect 0.8x1.2 smd: 1(-0.799,-0.004) 2(0.799,0.004)
OLED-TH_L27.8-W27.2-P2.54_C9900033791
  round 1.8 hole 1.05: 1(-3.81,0) 2(-1.27,0) 3(1.27,0) 4(3.81,0)
Pad_e60
  round 4.3 hole 4: 1(0,0)
Pad_e64
  round 4.3 hole 4: 1(0,0)
Pad_e66
  round 4.3 hole 4: 1(0,0)
Pad_e69
  round 4.3 hole 4: 1(0,0)
R0603
  rect 0.806x0.864 smd: 1(-0.753,0) 2(0.753,0)
SW-TH_SHOU-HAN_SS12D10G4
  oval 1.7x2.9 hole 1.1x2.3: 1(-4.8,0) 2(0,0) 3(4.8,0)

## Nets
As in the schematic, except:
5V: BEEP.1 BLE.1 H3.14 R3470.1 U2.18 主电源开关.1 摇杆.4
GND: BEEP.3 BLE.2 H3.12 LED5V1.1 OLED1.1 PA0开关1.3 SW1.1 SW2.1 SW3.1 SW4.1 U2.19 U3.1 U3.2 指示灯1.1 指示灯2.1 摇杆.5 步进电机1.9 步进电机1.10
A00: H3.2 MotorA.1
A01: H3.4 MotorA.2
B00: H3.6 MotorA.3
B01: H3.8 MotorA.4
PA9: BEEP.2 U2.6
PB6: BLE.4 U2.14
PB7: BLE.3 U2.15

Pads without a net: NOREF 1; NOREF#2 1; NOREF#3 1; NOREF#4 1; 主电源开关 3

## Via types
v1: diameter 3.3, hole 3, Top Layer to Bottom Layer, 12 vias
v2: diameter 0.61, hole 0.305, Top Layer to Bottom Layer, 219 vias

## Routing (per net, layer and track width the routed paths; a pad name or vN(x,y) marks a point on that pad's centre or on a via; arc(x,y) is an arc through that point)
3.3V: length 195.3
  Top Layer w0.4: v2(53.82,21.07) 58.88,21.07 R1kb8.2 R1kb9.2 v2(65.53,24.18) ; R1KA11.2 78.91,20.94 R1KA10.2 68.05,24.98 v2(67.93,24.98)
  Bottom Layer w0.4: 45.02,27.87 43.82,26.67 39.95,26.67 OLED1.2 28.35,18.27 16.75,18.27 8.35,26.67 8.35,59.86 U2.20 ; 45.02,27.87 47.02,27.87 v2(53.82,21.07) ; 45.02,27.87 45.02,28.27 53.09,36.34 U3.3 59.49,51.94 59.49,62.74 56.75,65.48 56.75,90.61 H3.13 ; 67.13,25.78 v2(67.93,24.98) ; 67.13,25.78 PA0开关1.1 ; 67.13,25.78 v2(65.53,24.18)
5V: length 196.8
  Top Layer w0.4: v2(18.56,13.51) 18.56,6.4 R3470.1 ; 4.83,24.59 3.23,26.19 3.23,36.96 BLE.1 4.83,51.25 U2.18 28.59,75.02 35.79,75.02 36.59,75.82 36.59,76.62 48.19,88.22 48.19,93.95 48.99,94.75 55.95,94.75 H3.14 61.15,93.55 98.35,56.35 98.35,46.74 摇杆.4
  Bottom Layer w0.4: v2(18.56,13.51) 18.16,13.91 主电源开关.1 8.28,24.59 4.83,24.59
5V1: length 78.9
  Bottom Layer w0.4: 主电源开关.2 20.16,21.51 20.16,36.91 16.26,40.81 16.26,64.01 29.86,77.61 33.06,77.61 33.86,76.81 33.86,75.61 34.66,74.81 38.26,74.81 39.46,73.61 步进电机1.2
GND:
  vias: v2(5.49,96.93) v2(5.49,91.85) v2(5.49,76.61) v2(5.49,61.37) v2(5.49,56.29) v2(5.49,46.13) v2(5.49,41.05) v2(5.49,15.65) v2(5.49,10.57) v2(5.49,5.49) v2(10.57,96.93) v2(10.57,81.69) v2(10.57,71.53) v2(10.57,66.45) v2(10.57,20.73) v2(10.57,15.65) v2(10.57,5.49) v2(14.04,56.01) v2(14.04,50.93) v2(15.65,96.93) v2(15.65,76.61) v2(15.65,71.53) v2(15.65,66.45) v2(15.65,15.65) v2(15.65,10.57) v2(15.65,5.49) v2(20.73,96.93) v2(20.73,81.69) v2(20.73,76.61) v2(20.73,71.53) v2(20.73,15.65) v2(20.73,10.57) v2(20.73,5.49) v2(21.95,66.8) v2(25.81,96.93) v2(25.81,81.69) v2(25.81,76.61) v2(25.81,15.65) v2(25.81,10.57) v2(27.03,71.88) v2(27.03,66.8) v2(30.89,96.93) v2(30.89,81.69) v2(30.89,15.65) v2(30.89,10.57) v2(30.89,5.49) v2(35.97,96.93) v2(35.97,81.69) v2(35.97,20.73) v2(35.97,15.65) v2(35.97,10.57) v2(35.97,5.49) v2(41.05,96.93) v2(41.05,20.73) v2(41.05,15.65) v2(41.05,10.57) v2(41.05,5.49) v2(46.13,96.93) v2(46.13,81.69) v2(46.13,25.81) v2(46.13,20.73) v2(46.13,15.65) v2(46.13,10.57) v2(46.13,5.49) v2(51.21,96.93) v2(51.21,76.61) v2(51.21,71.53) v2(51.21,30.89) v2(51.21,20.73) v2(51.21,15.65) v2(51.21,10.57) v2(56.29,96.93) v2(56.29,41.05) v2(56.29,35.97) v2(56.29,30.89) v2(56.29,15.65) v2(56.29,10.57) v2(56.29,5.49) v2(61.37,96.93) v2(61.37,91.85) v2(61.37,86.77) v2(61.37,76.61) v2(61.37,71.53) v2(61.37,66.45) v2(61.37,61.37) v2(61.37,56.29) v2(61.37,41.05) v2(61.37,35.97) v2(61.37,30.89) v2(61.37,15.65) v2(61.37,10.57) v2(61.37,5.49) v2(66.45,96.93) v2(66.45,91.85) v2(66.45,86.77) v2(66.45,81.69) v2(66.45,76.61) v2(66.45,71.53) v2(66.45,66.45) v2(66.45,61.37) v2(66.45,46.13) v2(66.45,30.89) v2(71.53,96.93) v2(71.53,91.85) v2(71.53,86.77) v2(71.53,81.69) v2(71.53,76.61) v2(71.53,71.53) v2(71.53,66.45) v2(71.53,61.37) v2(71.53,56.29) v2(71.53,46.13) v2(71.53,41.05) v2(76.61,96.93) v2(76.61,91.85) v2(76.61,86.77) v2(76.61,81.69) v2(76.61,76.61) v2(76.61,71.53) v2(76.61,66.45) v2(76.61,61.37) v2(76.61,56.29) v2(76.61,46.13) v2(76.61,41.05) v2(76.61,35.97) v2(76.61,15.65) v2(76.61,10.57) v2(76.61,5.49) v2(81.69,96.93) v2(81.69,91.85) v2(81.69,86.77) v2(81.69,81.69) v2(81.69,76.61) v2(81.69,71.53) v2(81.69,66.45) v2(81.69,61.37) v2(81.69,56.29) v2(81.69,46.13) v2(81.69,41.05) v2(81.69,35.97) v2(81.69,30.89) v2(81.69,20.73) v2(81.69,15.65) v2(81.69,10.57) v2(81.69,5.49) v2(86.77,96.93) v2(86.77,91.85) v2(86.77,86.77) v2(86.77,81.69) v2(86.77,76.61) v2(86.77,71.53) v2(86.77,66.45) v2(86.77,61.37) v2(86.77,56.29) v2(86.77,46.13) v2(86.77,41.05) v2(86.77,35.97) v2(86.77,30.89) v2(86.77,25.81) v2(86.77,10.57) v2(86.77,5.49) v2(91.85,96.93) v2(91.85,91.85) v2(91.85,86.77) v2(91.85,81.69) v2(91.85,76.61) v2(91.85,71.53) v2(91.85,66.45) v2(91.85,61.37) v2(91.85,46.13) v2(91.85,41.05) v2(91.85,30.89) v2(91.85,25.81) v2(91.85,20.73) v2(91.85,15.65) v2(91.85,5.49) v2(96.93,96.93) v2(96.93,91.85) v2(96.93,86.77) v2(96.93,81.69) v2(96.93,76.61) v2(96.93,71.53) v2(96.93,66.45) v2(96.93,61.37) v2(96.93,56.29) v2(96.93,41.05) v2(96.93,35.97) v2(96.93,30.89) v2(96.93,25.81) v2(96.93,20.73) v2(96.93,15.65) v2(96.93,10.57) v2(96.93,5.49)
(no net):
  vias: v1(10.03,89.99) v1(10.03,9.98) v1(15.62,38.03) v1(15.67,81.59) v1(27.87,28.47) v1(27.87,4.67) v1(51.32,28.47) v1(51.37,4.67) v1(59.11,81.36) v1(59.06,37.8) v1(90.04,89.99) v1(90.04,9.98)
A00: length 40.6
  Bottom Layer w0.4: MotorA.1 6.57,87.67 10.57,87.67 16.45,93.55 H3.2
A01: length 44.2
  Bottom Layer w0.4: MotorA.2 8.17,86.73 10.57,86.73 16.17,92.33 43.24,92.33 H3.4
A10: length 53
  Bottom Layer w0.4: H3.7 49.53,90.27 38.59,79.33 11.39,79.33 H2.1
A11: length 57.2
  Top Layer w0.4: H2.2 13.39,78.79 13.39,82.39 26.01,95.01 42.41,95.01 43.21,94.21 43.21,93.01 44.01,92.21 45.79,92.21 H3.5
B00: length 48.8
  Bottom Layer w0.4: H3.6 45.77,92.33 45.77,90.59 40.97,85.79 9.77,85.79 MotorA.3
B01: length 52.5
  Bottom Layer w0.4: MotorA.4 11.37,84.85 42.84,84.85 48.17,90.19 48.17,92.19 H3.8
B10: length 50.6
  Top Layer w0.4: H3.3 44.15,91.01 42.95,92.21 29.35,92.21 H2.3
B11: length 48.1
  Top Layer w0.4: H2.4 15.81,64.91 H3.1
PA0: length 52.1
  Top Layer w0.4: 64.14,26.18 48.64,26.18 32.47,42.34 23.27,42.34 U3.16
PA1: length 75.6
  Top Layer w0.4: v2(57.81,47.94) 25.01,47.94 U3.15
  Bottom Layer w0.4: 摇杆.3 97.02,47.94 v2(57.81,47.94)
PA2: length 61.4
  Top Layer w0.4: H3.11 54.61,71.8 v2(48.75,65.94)
  Bottom Layer w0.4: U3.14 39.55,59.94 45.95,59.94 46.75,60.74 46.75,63.94 v2(48.75,65.94)
PA3: length 60.3
  Top Layer w0.4: H3.9 52.07,70.32 48.09,66.34 48.09,64.74 v2(49.29,63.54)
  Bottom Layer w0.4: v2(49.29,63.54) 49.29,60.74 47.69,59.14 41.29,59.14 U3.13
PA6: length 61.7
  Top Layer w0.4: U3.10 36.92,47.15 58.86,47.15 59.66,46.35 59.66,45.95 61.66,43.95 67.66,43.95 指示灯1.2
PA7: length 63.8
  Top Layer w0.4: 指示灯2.2 86.86,21.55 65.11,43.3 43.51,43.3 42.86,43.95 39.44,43.95 U3.9
PA8: length 20.4
  Top Layer w0.4: 步进电机1.8 43.44,62.81 46.62,62.81 U2.5
PA9: length 67.3
  Top Layer w0.4: U2.6 47.07,59.82 v2(47.07,58.45) ; BEEP.2 4.83,22.39 6.03,23.59 6.03,23.76 19.18,36.91 19.18,40.28 20.54,41.65 v2(21.23,41.65)
  Bottom Layer w0.4: v2(21.23,41.65) 30.83,41.65 34.03,44.85 34.03,46.85 32.83,48.05 32.83,48.85 42.43,58.45 v2(47.07,58.45)
PA10: length 65.3
  Top Layer w0.4: 72.14,11.26 LED15.1 v2(72.93,15.82) ; U2.7 54.93,49.42 58.53,49.42 v2(62.93,45.02)
  Bottom Layer w0.4: v2(62.93,45.02) 63.33,45.02 71.33,37.02 71.33,17.42 v2(72.93,15.82)
PA11: length 70.6
  Top Layer w0.4: 78.87,11.26 LED16.1 79.99,16.27 79.99,21.95 73.33,28.62 72.39,28.62 63.99,37.02 v2(63.99,42.62) ; U2.8 53.19,48.62 58.39,48.62 61.99,45.02 v2(61.99,44.62)
  Bottom Layer w0.4: v2(61.99,44.62) v2(63.99,42.62)
PB0: length 58.9
  Top Layer w0.4: v2(57.07,50.62) 摇杆.2
  Bottom Layer w0.4: v2(57.07,50.62) 45.47,50.62 U3.8
PB1: length 39.3
  Top Layer w0.4: v2(46.48,49.09) v2(46.48,51.89)
  Bottom Layer w0.4: v2(46.48,51.89) 46.48,54.18 51.82,59.51 51.82,64.97 40.64,76.15 步进电机1.1 ; U3.7 v2(46.48,49.09)
PB3: length 40.1
  Top Layer w0.4: H3.10 50.77,92.25 50.77,81.42 v2(41.97,72.62)
  Bottom Layer w0.4: v2(41.97,72.62) 32.77,63.42 U2.11
PB4: length 15.7
  Bottom Layer w0.4: 步进电机1.7 31.44,74.95 31.44,62.63 U2.12
PB5: length 72.9
  Top Layer w0.4: U2.13 35.95,53.16 v2(47.55,53.16) ; v2(58.74,53.16) 摇杆.1
  Bottom Layer w0.4: v2(47.55,53.16) v2(58.74,53.16)
PB6: length 41.6
  Top Layer w0.4: 4.83,30.94 13.71,39.82 13.71,46.22 14.51,47.02 v2(17.31,47.02)
  Bottom Layer w0.4: U2.14 25.15,53.02 19.15,47.02 v2(17.31,47.02)
PB7: length 39
  Top Layer w0.4: v2(17.17,47.82) 12.77,47.82 11.17,46.22 11.17,39.82 BLE.3 ; v2(19.81,48.62) 19.81,58.62 U2.15
  Bottom Layer w0.4: v2(19.81,48.62) 17.97,48.62 v2(17.17,47.82)
PB8: length 73.2
  Top Layer w0.4: 58.93,11.26 LED11.1 32.41,41.42 22.41,41.42 18.81,45.02 18.81,60.16 U2.16
PB9: length 78.9
  Top Layer w0.4: v2(33.53,48.62) 25.13,57.02 v2(21.93,57.02) ; 65.54,11.26 LED12.1 66.33,15.95 66.33,25.42 64.73,27.02 57.13,27.02 v2(41.13,43.02)
  Bottom Layer w0.4: U2.17 v2(21.93,57.02) ; v2(41.13,43.02) 39.13,45.02 39.13,46.22 36.73,48.62 v2(33.53,48.62)
PB10: length 19.2
  Bottom Layer w0.4: OLED1.3 40.89,40.97 U3.6
PB11: length 19.2
  Bottom Layer w0.4: OLED1.4 48.01,32.85 U3.5
PB12: length 29.7
  Top Layer w0.4: v2(43.98,75.61) 43.18,74.81 36.38,74.81 步进电机1.6
  Bottom Layer w0.4: v2(43.98,75.61) U2.1
PB13: length 28.2
  Bottom Layer w0.4: U2.2 55.63,62.5 40.78,77.35 36.38,77.35 步进电机1.5
PB14: length 20.4
  Top Layer w0.4: U2.3 51.7,62.81 48.52,62.81 37.72,73.61
PB15: length 21.2
  Bottom Layer w0.4: 37.72,76.15 38.92,74.95 40.92,74.95 50.55,65.32 U2.4
$1N1920: length 3.2
  Top Layer w0.4: R3470.2 17.23,6.13 LED5V1.2
$1N2056: length 3
  Top Layer w0.4: R1kb8.1 58.93,16.5
$1N2059: length 2.8
  Top Layer w0.4: R1kb9.1 65.53,16.75
$1N2097: length 2.8
  Top Layer w0.4: R1KA10.1 72.09,16.67 LED15.2
$1N2098: length 2.8
  Top Layer w0.4: R1KA11.1 78.86,19.39 LED16.2
$1N9373: length 9.9
  Top Layer w0.4: LED18.2 64.94,28.57 71.07,28.57 PA0开关1.2

## Copper pours and planes (outline as drawn; the poured copper is in the pictures)
GND on Top Layer: -24,124.28 119.13,124.28 119.13,-19.35 -24,-19.35
GND on Bottom Layer: 7.19,20.65 -6.1,20.65 -14.73,12.01 -14.73,-4.24 -10.67,-8.31 107.32,-8.31 123.83,8.2 123.83,93.93 128.4,98.5 103.12,123.77 -15.88,123.77 -16.64,124.54 -32.89,108.28 -32.89,47.7 -12.32,27.13 12.57,27.13 12.57,18.75 12.19,18.36 7.62,18.36 7.62,20.22

## Text on the board
Top Silkscreen Layer: MotorB | Laser Tracking / & Control | OFF | ON | YIBAI TEAM | 5V | 解锁 | GND | 3.3V

# Board PCB2
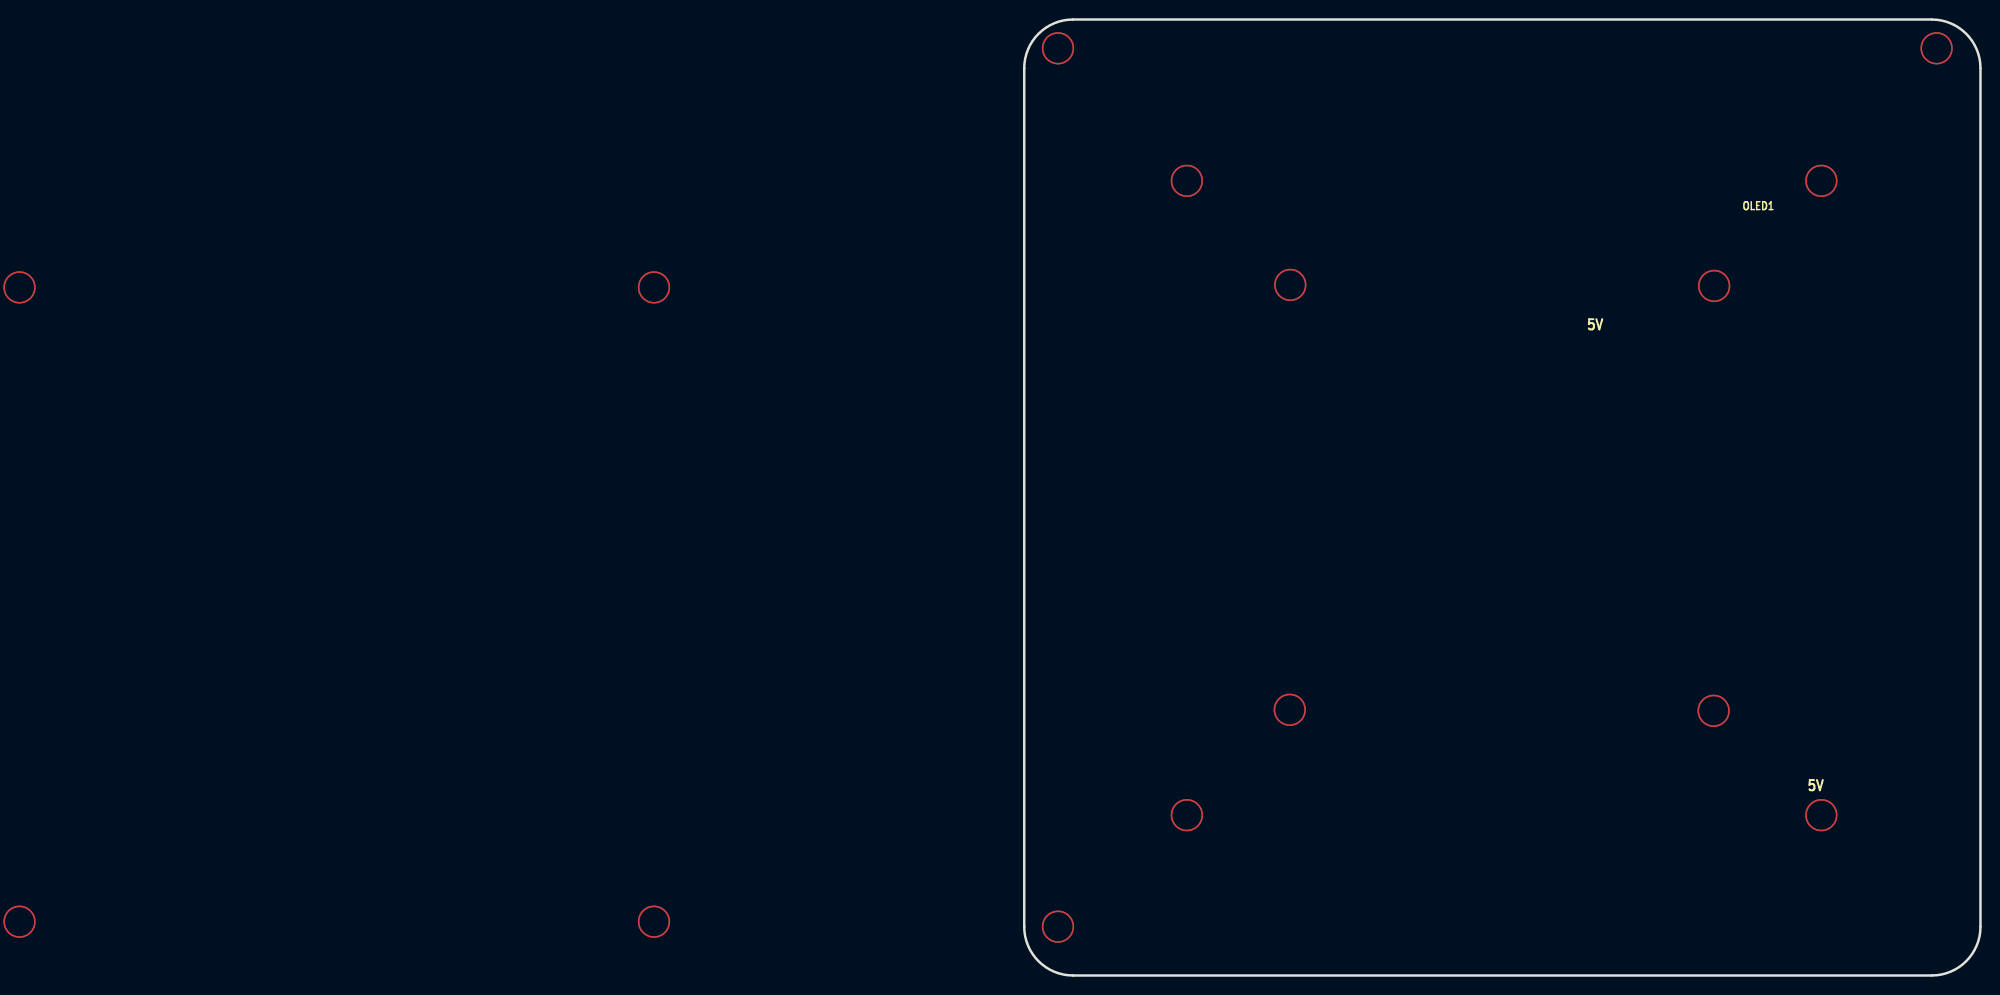
[diagram p3: board, top side]
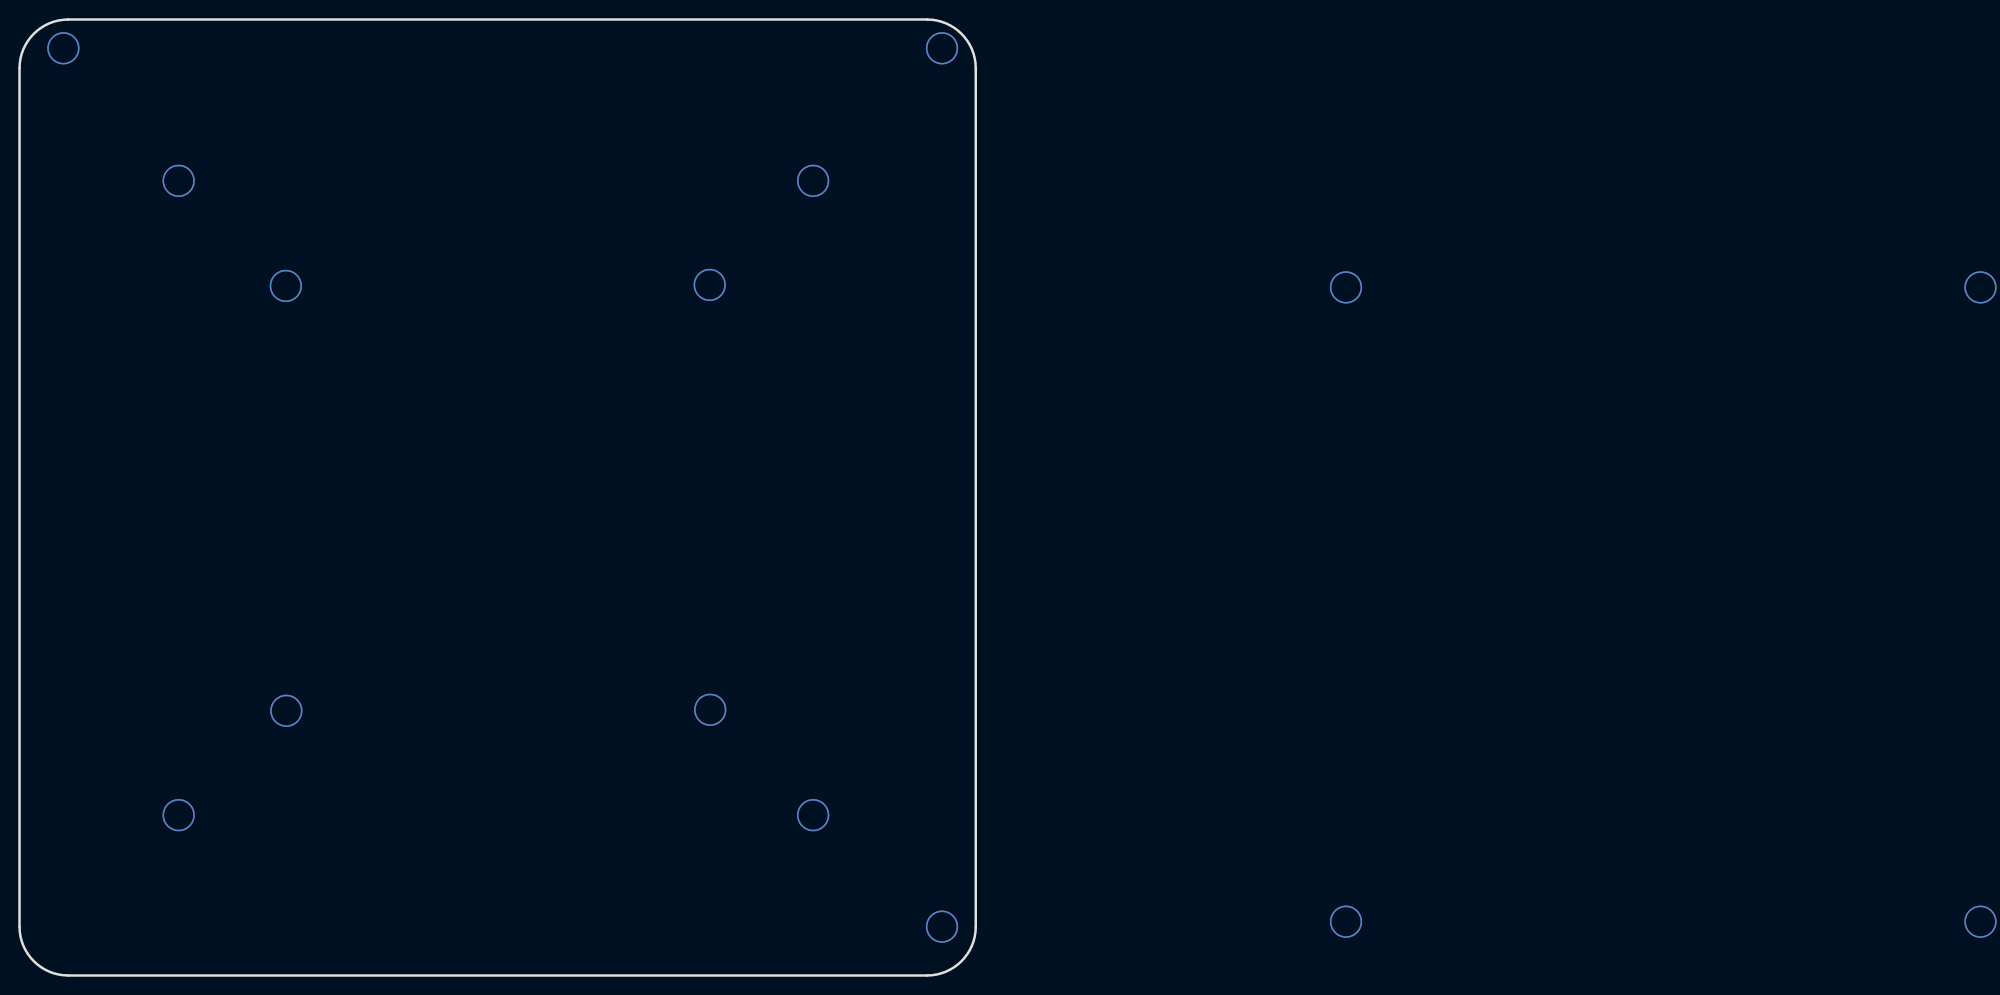
[diagram p4: board, bottom side, seen from below]

Outline 98 x 98 mm; copper layers: Top Layer, Bottom Layer. Coordinates in mm from the lower left corner of the outline.
Outline path: 0,93 0,5 arc(1.46,1.46) 5,0 93,0 arc(96.54,1.46) 98,5 98,93 arc(96.54,96.54) 93,98 5,98 arc(1.46,96.54) 0,93
Stack: Top Layer 0.035mm / Dielectric1 1.51mm FR4 er 4.5 / Bottom Layer 0.035mm

## Design rules (mm)
template: JLCPCB Capability(Two Layers Board)
spacing copperThickness1oz (default): track to track 0.102, other pairs 0.152 to 0.3
spacing copperThickness2oz: track to track 0.203, other pairs 0.152 to 0.3
track width copperThickness1oz (default): min 0.127, default 0.254, max 2.54
track width copperThickness2oz: min 0.203, default 0.254, max 2.54
differential pair differentialPair (default): width min 0.127, default 0.254, max 2.54; gap min 0.152, default 0.152
via viaSize (default): diameter min 0.5, default 0.61, max 10; hole min 0.3, default 0.305, max 6.3

## Placement (name value [footprint] x y rotation side)

## Nets

## Via types
v1: diameter 3.3, hole 3, Top Layer to Bottom Layer, 15 vias

## Routing (per net, layer and track width the routed paths; a pad name or vN(x,y) marks a point on that pad's centre or on a via; arc(x,y) is an arc through that point)
(no net):
  vias: v1(-102.97,70.54) v1(-102.97,5.51) v1(-37.94,70.54) v1(-37.94,5.51) v1(3.46,95.05) v1(3.46,5.01) v1(16.67,81.46) v1(16.67,16.44) v1(27.27,70.79) v1(27.21,27.24) v1(70.65,27.13) v1(70.71,70.69) v1(81.69,81.46) v1(81.69,16.44) v1(93.5,95.05)

## Copper pours and planes (outline as drawn; the poured copper is in the pictures)
GND on Top Layer: 127.79,81.59 202.98,81.59 205.13,79.43 205.13,7.42 205.26,7.29 194.21,7.29 193.58,7.93 193.58,14.28 187.1,20.75 183.42,20.75 183.42,26.64 182.66,27.41 170.29,27.41 169.45,28.25 169.45,22.17 169.96,21.66 166,21.66 165.26,22.41 165.26,27.48 152.56,27.48 152.43,27.36 152.43,20.67 152.56,20.54 166.1,20.54 166.78,19.87 187.23,19.87 192.18,14.91 192.18,14.66 192.82,14.02 192.82,7.67 131.73,7.67 127.79,11.61
GND on Bottom Layer: -133.45,99.88 -131.03,97.46 -52.55,97.46 -52.55,31.68 -62.45,21.77 -65.76,21.77 -68.68,24.69 -68.68,31.8 -75.28,38.41 -78.96,38.41 -79.09,38.53 -79.09,44.88 -92.3,44.88 -92.55,45.14 -92.68,45.01 -92.68,38.53 -96.59,38.53 -97.12,39.07 -97.12,44.88 -97,45.01 -109.95,45.01 -110.08,45.14 -110.21,45.01 -110.21,38.66 -98.26,38.66 -97.83,38.23 -77.14,38.23 -70.71,31.8 -69.82,31.8 -69.82,26.22 -69.44,25.83 -131.42,25.83 -133.07,24.18 -133.07,83.11 -132.3,83.87 -133.45,85.02

## Text on the board
Top Silkscreen Layer: OLED1 | 5V
